# EAGLE design PRTF01 (EAGLE 6.6.0)
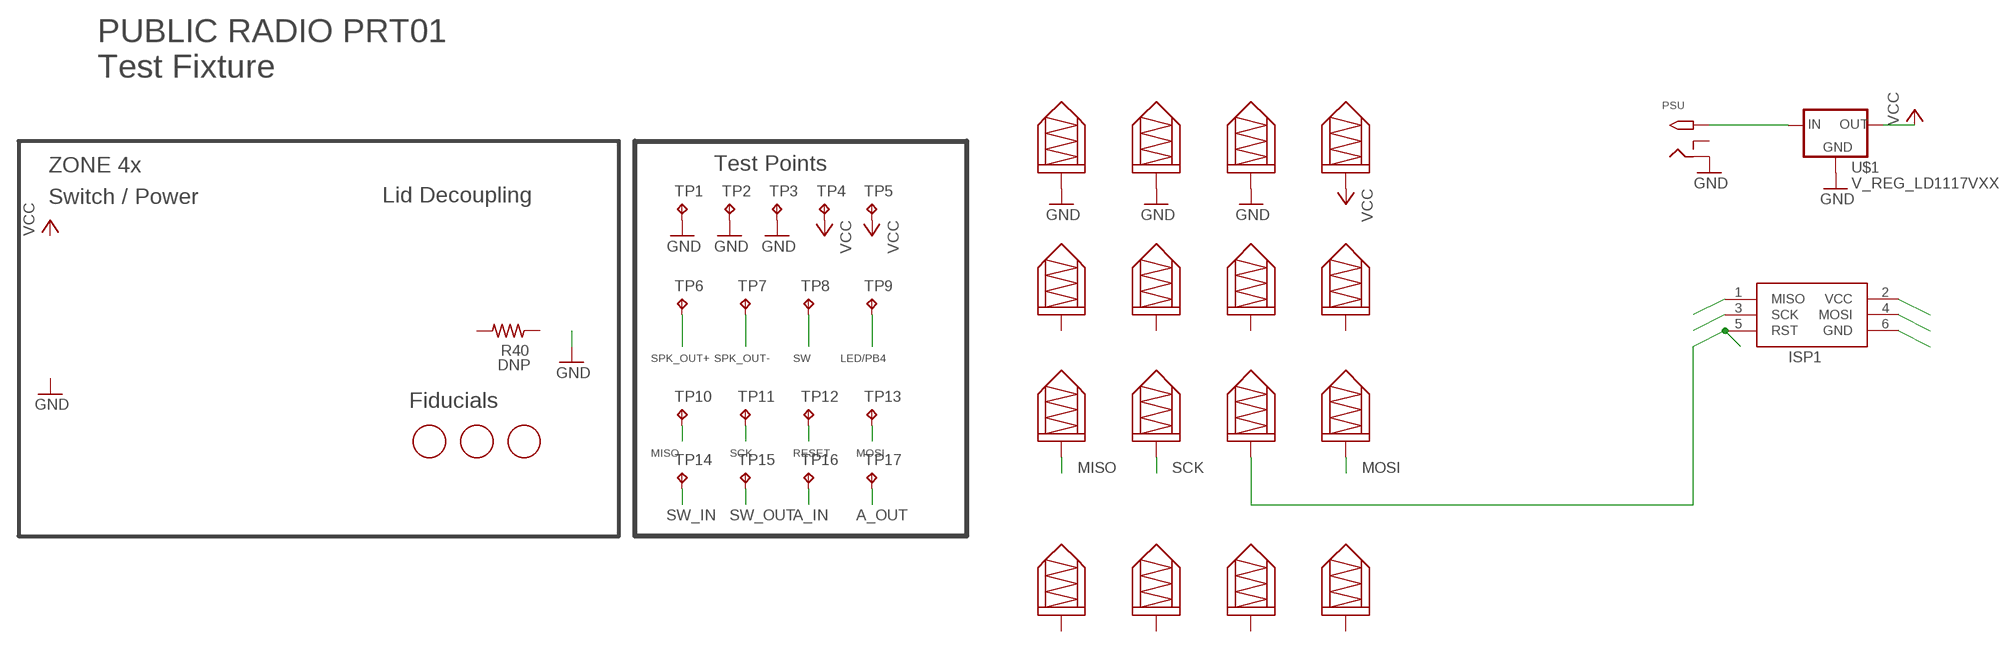
[diagram p0: schematic, sheet 1]

## Parts
ISP1  AVRISP-6  [AVRISP]
MARK1  FIDUCIAL  [FIDUCIAL_1MM]
MARK2  FIDUCIAL  [FIDUCIAL_1MM]
MARK3  FIDUCIAL  [FIDUCIAL_1MM]
P1  0908MILL_MAX_SPRINGPIN  [0908MILL_MAX_SPRINGPIN]
P2  0908MILL_MAX_SPRINGPIN  [0908MILL_MAX_SPRINGPIN]
P3  0908MILL_MAX_SPRINGPIN  [0908MILL_MAX_SPRINGPIN]
P4  0908MILL_MAX_SPRINGPIN  [0908MILL_MAX_SPRINGPIN]
P6  0908MILL_MAX_SPRINGPIN  [0908MILL_MAX_SPRINGPIN]
P8  0908MILL_MAX_SPRINGPIN  [0908MILL_MAX_SPRINGPIN]
P9  0908MILL_MAX_SPRINGPIN  [0908MILL_MAX_SPRINGPIN]
P10  0908MILL_MAX_SPRINGPIN  [0908MILL_MAX_SPRINGPIN]
P11  0908MILL_MAX_SPRINGPIN  [0908MILL_MAX_SPRINGPIN]
P12  0908MILL_MAX_SPRINGPIN  [0908MILL_MAX_SPRINGPIN]
P13  0908MILL_MAX_SPRINGPIN  [0908MILL_MAX_SPRINGPIN]
P14  0908MILL_MAX_SPRINGPIN  [0908MILL_MAX_SPRINGPIN]
P15  0908MILL_MAX_SPRINGPIN  [0908MILL_MAX_SPRINGPIN]
P16  0908MILL_MAX_SPRINGPIN  [0908MILL_MAX_SPRINGPIN]
P17  0908MILL_MAX_SPRINGPIN  [0908MILL_MAX_SPRINGPIN]
PSU  2.1MMJACKTHM  [PJ-102A]
R40  DNP  R_SMT_R0603_CPL  [0603_CPL]
TP1  TPTP20R  [TP20R]
TP2  TPTP20R  [TP20R]
TP3  TPTP20R  [TP20R]
TP4  TPTP20R  [TP20R]
TP5  TPTP20R  [TP20R]
TP6  TPTP20R  [TP20R]
TP7  TPTP20R  [TP20R]
TP8  TPTP20R  [TP20R]
TP9  TPTP20R  [TP20R]
TP10  TPTP20R  [TP20R]
TP11  TPTP20R  [TP20R]
TP12  TPTP20R  [TP20R]
TP13  TPTP20R  [TP20R]
TP14  TPTP20R  [TP20R]
TP15  TPTP20R  [TP20R]
TP16  TPTP20R  [TP20R]
TP17  TPTP20R  [TP20R]
U$1  V_REG_LD1117VXX  [78XXL]
U$P7  0908MILL_MAX_SPRINGPIN  [0908MILL_MAX_SPRINGPIN]

## Nets
!RST: TP10.TP
A_IN: TP16.TP
A_OUT: TP17.TP
GND: P1.P$1 P2.P$1 P3.P$1 PSU.RING TP1.TP TP2.TP TP3.TP U$1.IN(GND)
LED/PB4: TP9.TP
MISO: ISP1.1(MISO) P10.P$1
MOSI: ISP1.4(MOSI) P13.P$1
N$1: PSU.TIP U$1.OUT(IN)
N$9: ISP1.2(VCC)
N$11: ISP1.6(GND)
RESET: ISP1.5(RST) P12.P$1 TP12.TP
SCK: ISP1.3(SCK) P11.P$1
SCLK: TP11.TP
SDIO: TP13.TP
SPK_OUT+: TP6.TP
SPK_OUT-: TP7.TP
SW: TP8.TP
SW_IN: TP14.TP
SW_OUT: TP15.TP
VCC: P4.P$1 TP4.TP TP5.TP U$1.GND(OUT)
Unconnected: P6.P$1 P8.P$1 P9.P$1 P14.P$1 P15.P$1 P16.P$1 P17.P$1 PSU.RING_SW R40.1 R40.2 U$P7.P$1

## Notes on the sheet
- PUBLIC RADIO PRT01
  Test Fixture
- ZONE 4x | Test Points
- Switch / Power | Lid Decoupling
- Fiducials
- MISO | SCK | RESET | MOSI

## Library data of the parts
ISP1 = adafruit:AVRISP: AVR ISP HEADER Standard 6 pin header for AVR programming
MARK1-MARK3 = PR_Parts_Library:FIDUCIAL: 1mm fiducial.; MFG_PN: DNP
P1-P4 P6 P8-P17 U$P7 = PR_Parts_Library:0908MILL_MAX_SPRINGPIN: MFG# 0908-1-15-20-75-14-11-0; MFG#: 0908-1-15-20-75-14-11-0
PSU = adafruit:2.1MMJACK: 2.1mm x 5.5mm THM DC jack with internal switch. Digikey part #PJ-102A, 4UCON part #05537 2.1mm x 5.5mm SMT DC jack with internal switch. Digikey part #PJ-002A-SMT, 4UCON part #03267 By microbuilder.eu & adafruit.com
R40 = PR_Parts_Library:R_SMT: SMT resistor; MFG_PN: ERJ-3GEY0R00V
TP1-TP17 = PR_Parts_Library:TP: Test pad; MFG_PN: DNP
U$1 = SparkFun-PowerIC:V_REG_LD1117VXX: LD1117VXX voltage regulator. We carry the 3.3V version (COM-00526) in TO-220 package.

## Net classes
1 antenna: clearance 1.27 mm

## Board
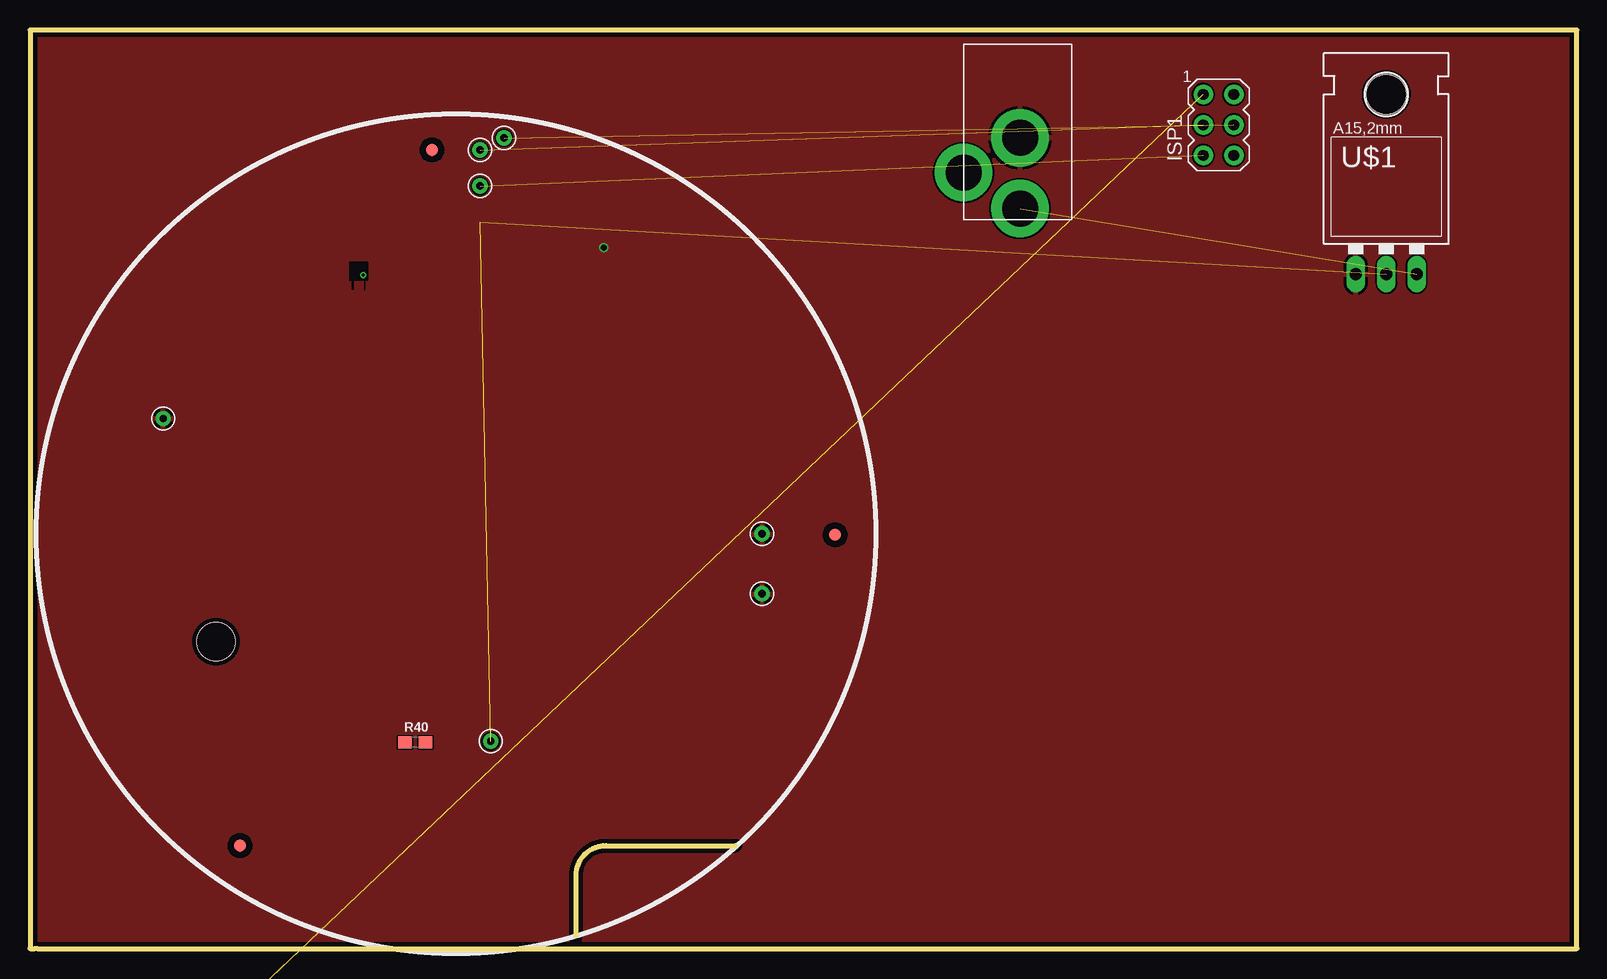
[diagram p1: board, top side]
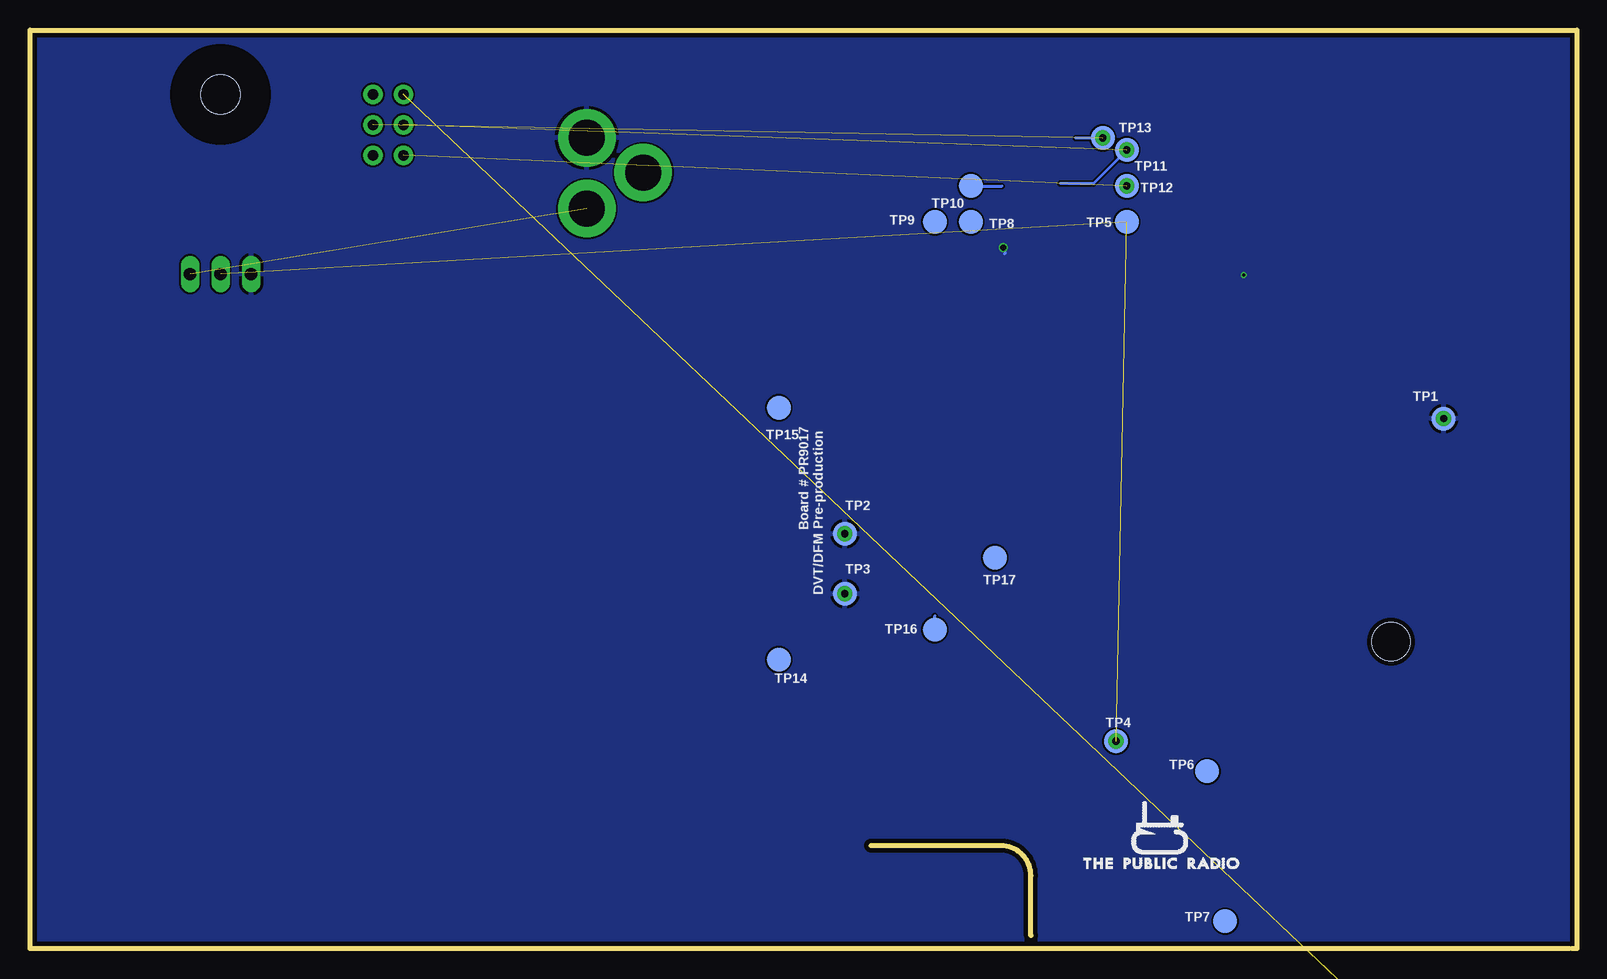
[diagram p2: board, bottom side, seen from below]

Size 128.9 x 76.6 mm. Coordinates in mm from the lower left corner, seen from the top.
Outline: 45.5,1.1 45.5,6.1 arc-90 48,8.6 58.8,8.6
Outline: 0.6,0 128.9,0 128.9,76.6 0,76.6 0,0 0.4,0
Copper layers (1*16): Top 0.0356mm / dielectric 1.5011mm / Bottom 0.0356mm
Design rules "LaenPCBOrder *": minimum track width 6mil, minimum drill 13mil, track to track 6mil, track to pad 6mil, pad to pad 6mil, via to via 6mil, smd to smd 6mil, copper to edge 15mil, drill to drill 6mil, minimum pad ring 7mil, minimum via ring 5mil, stop-mask expansion 3mil, vias tented up to drill 0mil, thermal gap 10mil
Holes 3.2 mm at 15.5,25.6
tRestrict: area 26.6,55.7 to 28.2,57.3; 8 lines

### Footprints (pad centres in the part's own frame; a part is rotated, then mirrored left to right if it is on the bottom)
AVRISP = drill 0.9 pad 1.626: 1 -1.27,2.54; 2 1.27,2.54; 3 -1.27,0; 4 1.27,0; 5 -1.27,-2.54; 6 1.27,-2.54
FIDUCIAL_1MM = smd 1 x 1: 1 0,0
0908MILL_MAX_SPRINGPIN = drill 0.6 pad 1.27: P$1 0,0
PJ-102A = drill 3 pad 4.8: RING 0.1,-3.39; RING_SW -4.6,-6.29; TIP 0.1,-9.29
0603_CPL = smd 1.1 x 1: 1 -0.85,0; 2 0.85,0
TP20R = smd 2 x 2: TP 0,0
78XXL = drill 1.016 long: GND 0,-3.81; IN -2.54,-3.81; OUT 2.54,-3.81 | hole 3.302: 0,11.176

### Placement (x,y rotation side)
ISP1  99.05,68.69 0 top
MARK1  17.5,8.6 0 top
MARK2  33.5,66.6 0 top
MARK3  67.1,34.5 0 top
P1  11.1,44.2 0 top
P2  61,29.6 0 top
P3  61,34.6 0 top
P4  38.4,17.3 0 top
P6  0.9,-12.2 0 top  (outside the outline)
P8  0.9,-16.4 0 top  (outside the outline)
P9  0.9,-18.5 0 top  (outside the outline)
P10  0.9,-20.6 0 top  (outside the outline)
P11  37.5,66.6 0 top
P12  37.5,63.59 0 top
P13  39.5,67.6 0 top
P14  0.9,-29 0 top  (outside the outline)
P15  0.9,-31.1 0 top  (outside the outline)
P16  0.9,-33.2 0 top  (outside the outline)
P17  0.9,-35.3 0 top  (outside the outline)
PSU  82.4,71 0 top
R40  32.1,17.2 180 top
TP1  11.1,44.2 0 bottom
TP2  61,34.6 0 bottom
TP3  61,29.6 0 bottom
TP4  38.4,17.3 0 bottom
TP5  37.5,60.6 0 bottom
TP6  30.8,14.8 0 bottom
TP7  29.3,2.3 0 bottom
TP8  50.5,60.6 0 bottom
TP9  53.5,60.6 0 bottom
TP10  50.5,63.6 0 bottom
TP11  37.5,66.6 0 bottom
TP12  37.5,63.6 0 bottom
TP13  39.5,67.6 0 bottom
TP14  66.5,24.1 0 bottom
TP15  66.5,45.1 0 bottom
TP16  53.5,26.6 0 bottom
TP17  48.5,32.6 0 bottom
U$1  113.02,60.05 0 top
U$P7  0.9,-14.3 0 top  (outside the outline)

### Tracks (layer width: path | path; a pad name or v marks a point on that pad's centre or on a via)
!RST
  Bottom 0.254: TP10.TP 47.91,63.6
A_IN
  Bottom 0.254: TP16.TP 53.5,27.76
GND  (via drill 0.25, 0.5)
  Top 0.2: 27.65,56.04 v27.76,56.15
  Bottom 0.254: 47.68,58.44 47.68,57.93
  other vias: 47.8,58.45
  pour Bottom: -2.04,-0.4 130.04,-0.4 130.04,78.34 -2.04,78.34
  pour Top: -2.04,-0.4 130.04,-0.4 130.04,78.34 -2.04,78.34
MISO  (1 unrouted)
MOSI  (1 unrouted)
N$1  (1 unrouted)
N$21
  pour Bottom: 
RESET  (2 unrouted)
SCK  (1 unrouted)
SCLK
  Bottom 0.254: 43.03,63.8 40.3,63.8 TP11.TP
SDIO
  Bottom 0.254: TP13.TP 41.77,67.6
VCC  (2 unrouted)

### Text on the board
bNames: Board # PR9017 / DVT/DFM Pre-production